# Altium schematic sheet MMA8453Q.SchDoc
size A
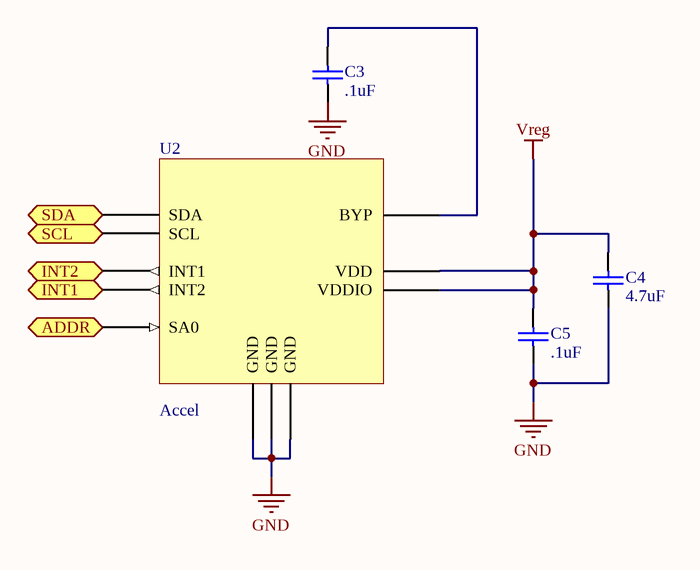
[diagram p0: MMA8453Q.SchDoc]

## Parts
C3  value .1uF  [1608[0603]]  (hidden comment: Cap)
C4  value 4.7uF  [1608[0603]]  (hidden comment: Cap)
C5  value .1uF  [1608[0603]]  (hidden comment: Cap)
U2  Accel  [QFN16 3x3mm 5x3 pin]

## Ports
ADDR (in), INT1 (out), INT2 (out), SCL (bidir), SDA (bidir)

## Nets
GND: C3.1 C4.1 C5.1 U2.5(GND) U2.10(GND) U2.12(GND)
Vreg: C4.2 C5.2 U2.1(VDDIO) U2.14(VDD)
ADDR: U2.7(SA0) ; port ADDR
INT1: U2.9(INT2) ; port INT1
INT2: U2.11(INT1) ; port INT2
SCL: U2.4(SCL) ; port SCL
SDA: U2.6(SDA) ; port SDA
NetC3_2: C3.2 U2.2(BYP)

## Library data of the parts
C3-C5 = Cap Semi: Capacitor; Published: 8-Jun-2000; LatestRevisionDate: 29-May-2009; LatestRevisionNote: IPC-7351 Footprint Added.; PackageReference: C1206; Publisher: Altium Limited; PackageDescription: Chip Capacitor
U2 = MMA8453Q: 3 Axis I2C Ultra Low Power Accelerometer; Manufacturer: Freescale Semiconductor; Manufacturer Part Number: MMA8453QR1; Axis: X, Y, Z; Acceleration Range: ±2g, 4g, 8g; Sensitivity: 256LSB/g, 128LSB/g, 64LSB/g; Voltage - Supply: 1.95 V ~ 3.6 V; Output Type: I²C; Bandwidth: 800Hz; Interface: Serial; Supplier 1: Digi-Key; Supplier Part Number 1: MMA8453QR1CT-ND; RoHS: RoHS Compliant; Category: Sensors, Transducers; Stock 1: 5993; Pricing 1: 1=1.43, 10=1.275, 25=1.1984, 100=1.1475, 250=1.09652, 500=1.02 (USD); Packaging: Cut Tape (CT); Mounting Type: Surface Mount; Package / Case: 16-VFQFN; Supplier Device Package: 16-QFN (3x3); ComponentLink1URL: http://cache.freescale.com/files/sensors/doc/data_sheet/MMA8453Q.pdf; ComponentLink1Description: http://cache.freescale.com/files/sensors/doc/data_sheet/MMA8453Q.pdf